# EAGLE design Instrument Cluster (EAGLE 6.5.0)
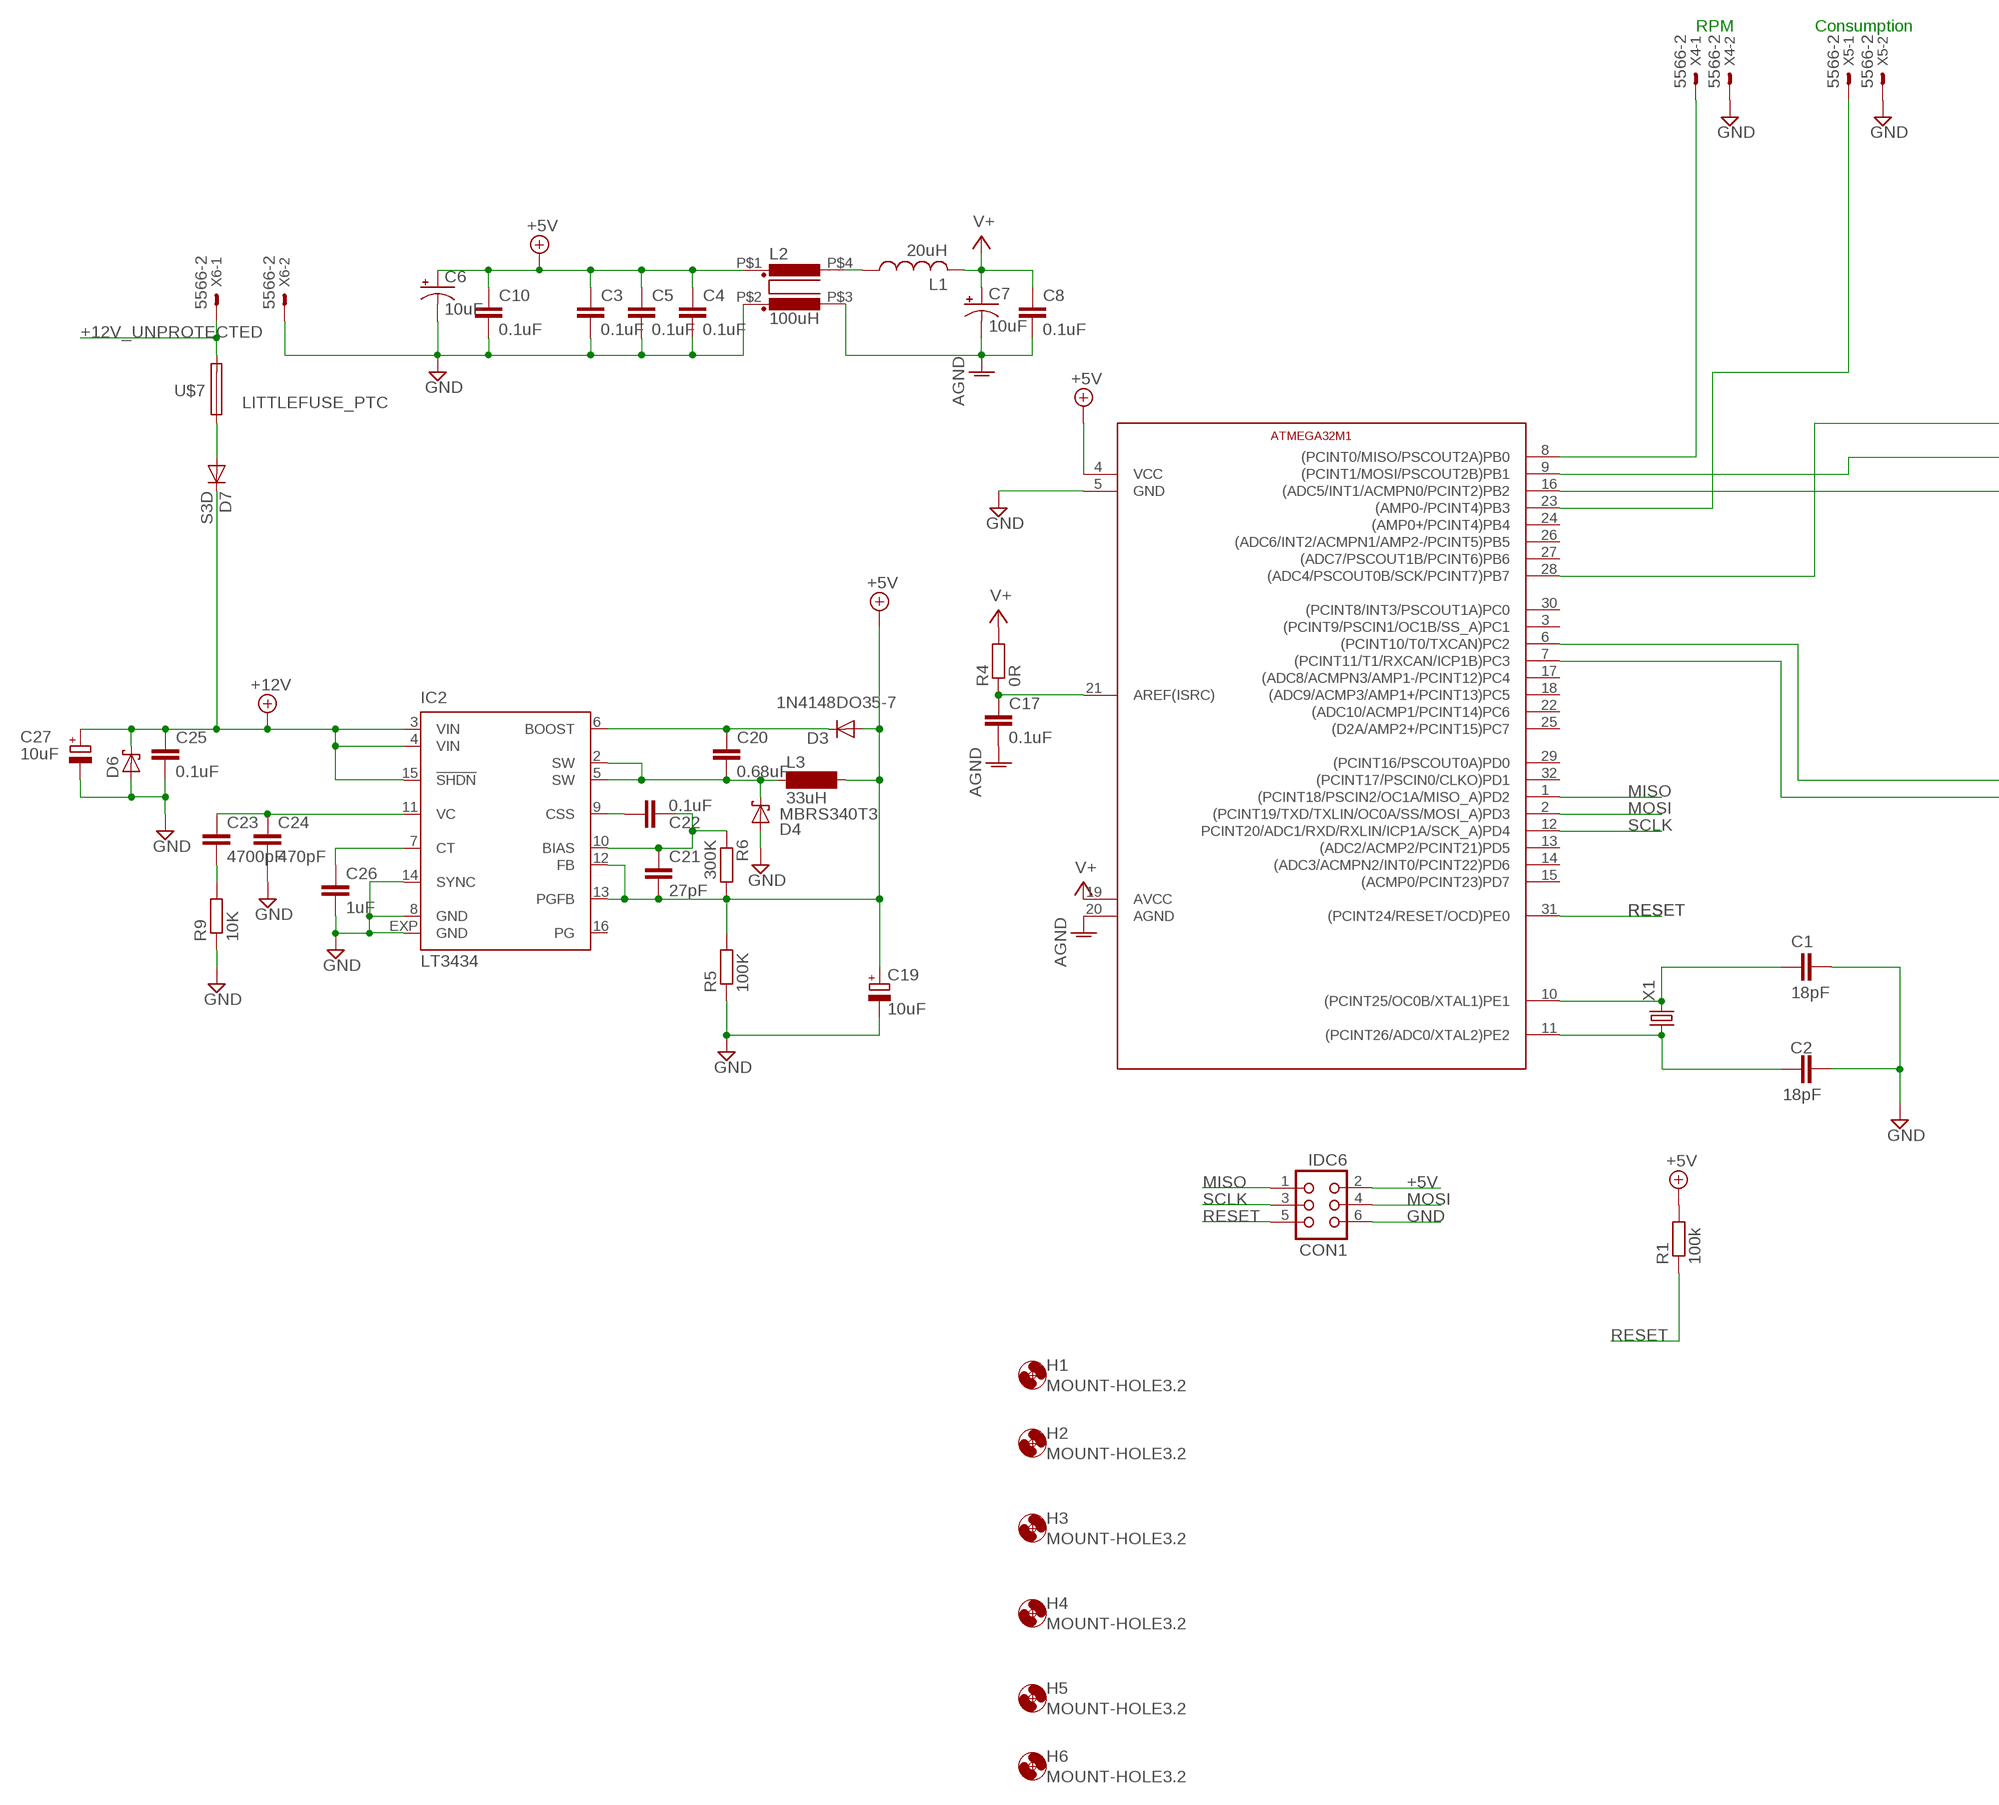
[diagram p0: schematic, sheet 1, part 1 of 2]
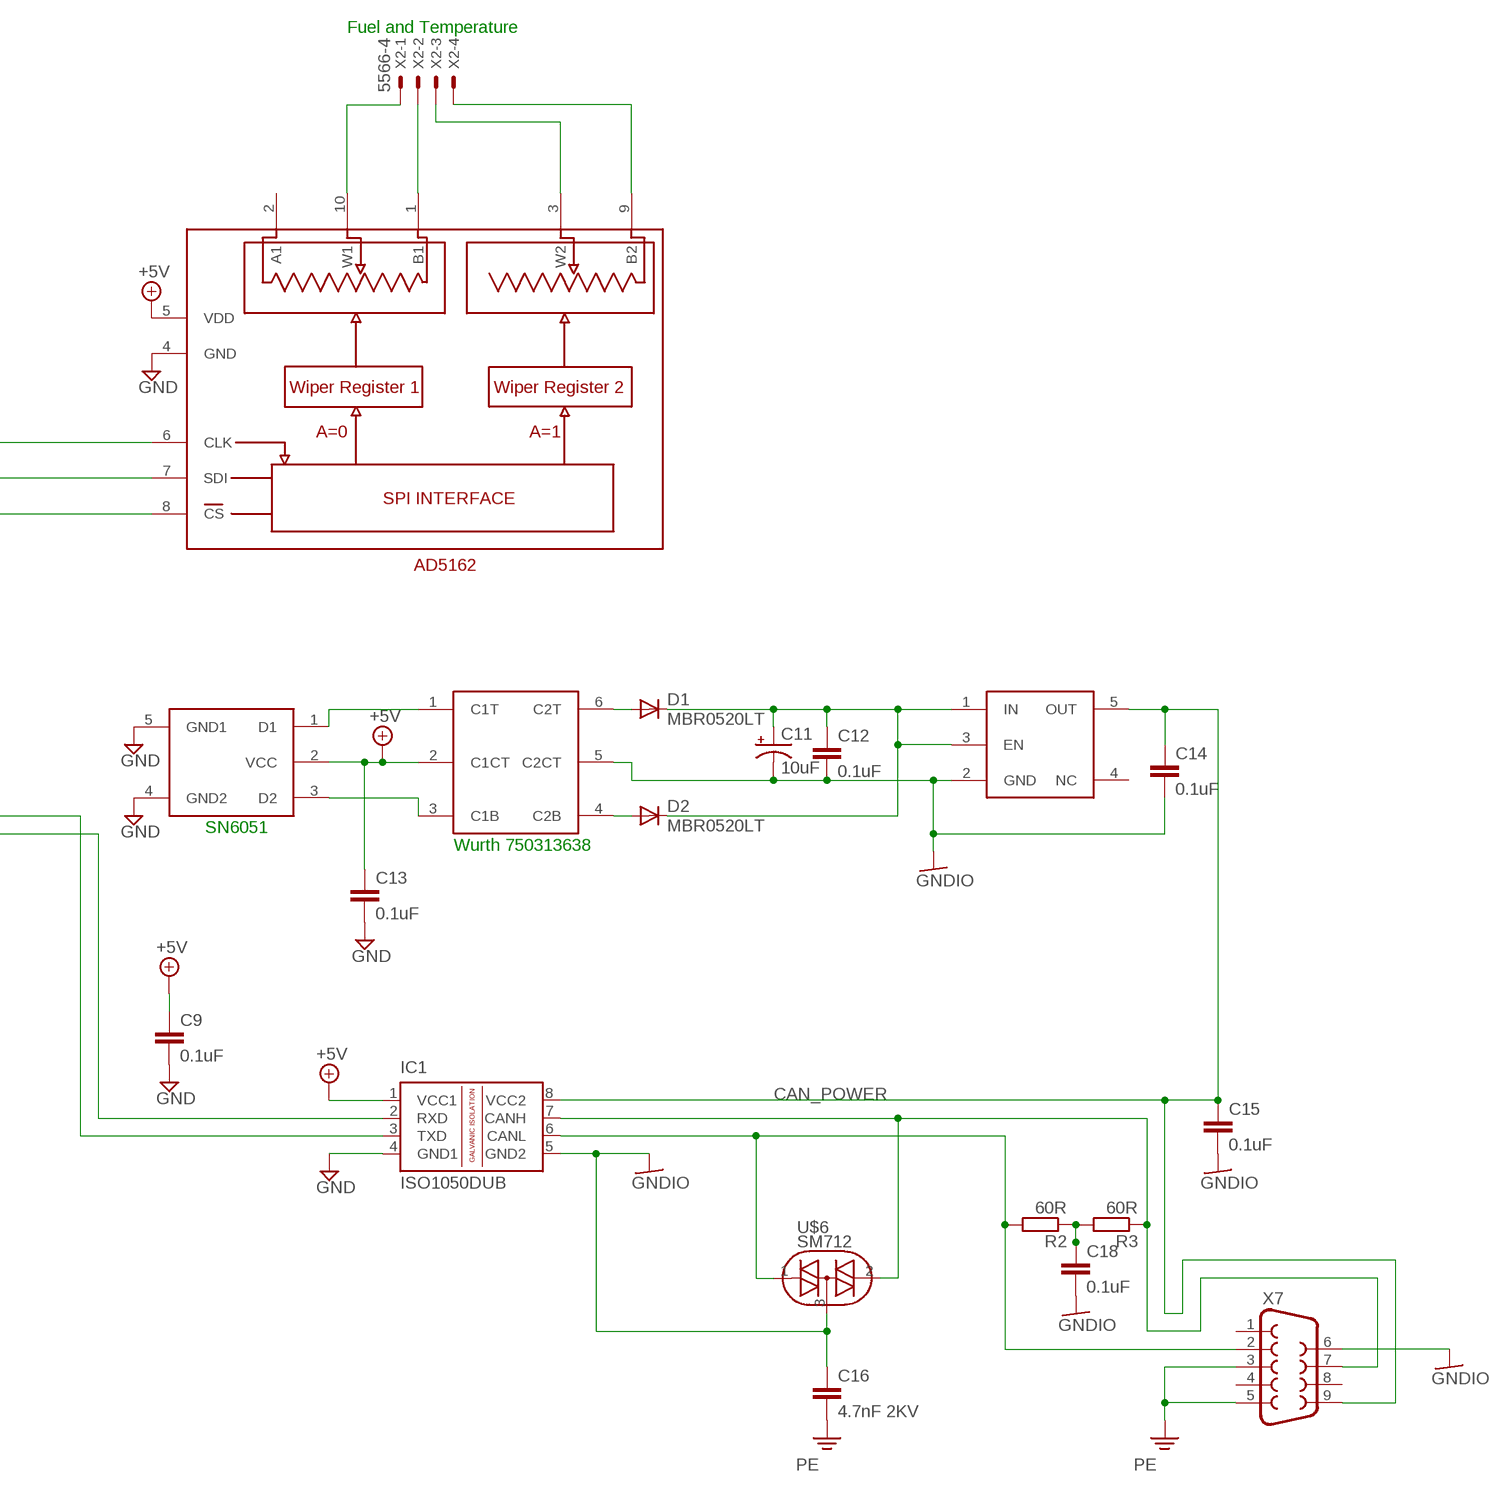
[diagram p1: schematic, sheet 1, part 2 of 2]

## Parts
C1  18pF  C-EUC0805  [C0805]
C2  18pF  C-EUC0805  [C0805]
C3  0.1uF  C-EUC0805  [C0805]
C4  0.1uF  C-EUC0805  [C0805]
C5  0.1uF  C-EUC0805  [C0805]
C6  10uF  CPOL-USSMCC  [SMC_C]
C7  10uF  CPOL-USSMCC  [SMC_C]
C8  0.1uF  C-EUC0805  [C0805]
C9  0.1uF  C-EUC0805  [C0805]
C10  0.1uF  C-EUC0805  [C0805]
C11  10uF  CPOL-USSMCD  [SMC_D]
C12  0.1uF  C-EUC0603  [C0603]
C13  0.1uF  C-EUC1206  [C1206]
C14  0.1uF  C-EUC1206  [C1206]
C15  0.1uF  C-EUC0603  [C0603]
C16  4.7nF 2KV  C-EUC1206  [C1206]
C17  0.1uF  C-EUC0805  [C0805]
C18  0.1uF  C-EUC1206  [C1206]
C19  10uF  CPOL-EUSMCD  [SMC_D]
C20  0.68uF  C-EUC0603  [C0603]
C21  27pF  C-EUC0603  [C0603]
C22  0.1uF  C-EUC0603  [C0603]
C23  4700pF  C-EUC0603  [C0603]
C24  470pF  C-EUC0603  [C0603]
C25  0.1uF  C-EUC0603  [C0603]
C26  1uF  C-EUC0603  [C0603]
C27  10uF  CPOL-EUSMCD  [SMC_D]
CON1  IDC6  CON06  [CON06]
D1  MBR0520LT  [SOD123]
D2  MBR0520LT  [SOD123]
D3  1N4148DO35-7  [DO35-7]
D4  MBRS340T3  [SMC]
D6  SCHOTTKY-DIODESMC  [SMC]
D7  S3D  DIODE-SMC  [SMC]
H1  MOUNT-HOLE3.2  [3,2]
H2  MOUNT-HOLE3.2  [3,2]
H3  MOUNT-HOLE3.2  [3,2]
H4  MOUNT-HOLE3.2  [3,2]
H5  MOUNT-HOLE3.2  [3,2]
H6  MOUNT-HOLE3.2  [3,2]
IC1  ISO1050DUB  [DUB-R-PDSO-G8]
IC2  LT3434  [TSSOP16EXP]
L1  20uH  L-USL3216C  [L3216C]
L2  100uH  R1003U  [CHIP]
L3  33uH  MS85  [MS85]
R1  100k  R-EU_R0603  [R0603]
R2  60R  R-EU_R0603  [R0603]
R3  60R  R-EU_R0603  [R0603]
R4  0R  R-EU_R0603  [R0603]
R5  100K  R-EU_R0603  [R0603]
R6  300K  R-EU_R0603  [R0603]
R9  10K  R-EU_R0603  [R0603]
U$1  ATMEGA32M1  [TQFP32-08]
U$2  AD5162  [MSOP10]
U$3  SN6501  [SOT23-DBV]
U$4  WURTHWURTH  [TSOT23-6_DDC]
U$5  TPS76350  [SOT23-DBV]
U$6  SM712  [SOT23]
U$7  LITTLEFUSE_PTC  [1812]
X1  CSM-7X-DU  [CSM-7X-DU]
X2  5566-4  [5566-4]
X4  5566-2  [5566-2]
X5  5566-2  [5566-2]
X6  5566-2  [5566-2]
X7  F09H  [F09H]

## Nets
+5V: C3.1 C4.1 C5.1 C6.+ C9.1 C10.1 C13.1 C19.+ C21.2 CON1.2 D3.A IC1.1(VCC1) IC2.12(FB) IC2.13(PGFB) L2.P$1 L3.2 R1.2 R5.2 R6.2 U$1.4(VCC) U$2.5(VDD) U$3.2(VCC) U$4.2(C1CT)
+12V: C25.1 C27.+ D6.C D7.C IC2.3(VIN) IC2.4(VIN) IC2.15(!SHDN)
+12V_UNPROTECTED: U$7.P$2 X6.1
AGND: C7.- C8.2 C17.2 L2.P$3 U$1.20(AGND)
CAN_POWER: C14.1 C15.1 IC1.8(VCC2) U$5.5(OUT) X7.9
GND: C1.1 C2.2 C3.2 C4.2 C5.2 C6.- C9.2 C10.2 C13.2 C19.- C24.2 C25.2 C26.2 C27.- CON1.6 D4.A D6.A IC1.4(GND1) IC2.8(GND) IC2.14(SYNC) IC2.EXP(GND) L2.P$2 R5.1 R9.1 U$1.5(GND) U$2.4(GND) U$3.4(GND2) U$3.5(GND1) X4.2 X5.2 X6.2
GNDIO: C11.- C12.2 C14.2 C15.2 C16.1 C18.2 IC1.5(GND2) U$4.5(C2CT) U$5.2(GND) U$6.3(T2) X7.6
MISO: CON1.1 U$1.1((PCINT18/PSCIN2/OC1A/MISO_A)PD2)
MOSI: CON1.4 U$1.2((PCINT19/TXD/TXLIN/OC0A/SS/MOSI_A)PD3)
N$1: C1.2 U$1.10((PCINT25/OC0B/XTAL1)PE1) X1.2
N$2: C2.1 U$1.11((PCINT26/ADC0/XTAL2)PE2) X1.1
N$3: U$1.9((PCINT1/MOSI/PSCOUT2B)PB1) U$2.7(SDI)
N$4: U$1.16((ADC5/INT1/ACMPN0/PCINT2)PB2) U$2.8(CS)
N$5: U$1.28((ADC4/PSCOUT0B/SCK/PCINT7)PB7) U$2.6(CLK)
N$6: U$2.10(W1) X2.1
N$7: U$2.1(B1) X2.2
N$8: U$2.3(W2) X2.3
N$9: U$2.9(B2) X2.4
N$10: IC1.3(TXD) U$1.6((PCINT10/T0/TXCAN)PC2)
N$11: IC1.2(RXD) U$1.7((PCINT11/T1/RXCAN/ICP1B)PC3)
N$12: U$3.1(D1) U$4.1(C1T)
N$13: U$3.3(D2) U$4.3(C1B)
N$14: D1.A U$4.6(C2T)
N$15: C11.+ C12.1 D1.C D2.C U$5.1(IN) U$5.3(EN)
N$16: C17.1 R4.1 U$1.21(AREF(ISRC))
N$17: L1.1 L2.P$4
N$18: D2.A U$4.4(C2B)
N$19: IC1.6(CANL) R2.2 U$6.1(T1) X7.2
N$20: IC1.7(CANH) R3.1 U$6.2(T3) X7.7
N$21: U$1.8((PCINT0/MISO/PSCOUT2A)PB0) X4.1
N$22: U$1.23((AMP0-/PCINT4)PB3) X5.1
N$23: C18.1 R2.1 R3.2
N$26: C22.1 IC2.9(CSS)
N$27: C20.1 D3.C IC2.6(BOOST)
N$28: C21.1 C22.2 IC2.10(BIAS) R6.1
N$29: C20.2 D4.C IC2.2(SW) IC2.5(SW) L3.1
N$30: C26.1 IC2.7(CT)
N$32: C23.1 C24.1 IC2.11(VC)
N$33: C23.2 R9.2
N$35: D7.A U$7.P$1
PE: C16.2 X7.3 X7.5
RESET: CON1.5 R1.1 U$1.31((PCINT24/RESET/OCD)PE0)
SCLK: CON1.3 U$1.12(PCINT20/ADC1/RXD/RXLIN/ICP1A/SCK_A)PD4)
V+: C7.+ C8.1 L1.2 R4.2 U$1.19(AVCC)
Unconnected: IC2.16(PG) U$1.3((PCINT9/PSCIN1/OC1B/SS_A)PC1) U$1.13((ADC2/ACMP2/PCINT21)PD5) U$1.14((ADC3/ACMPN2/INT0/PCINT22)PD6) U$1.15((ACMP0/PCINT23)PD7) U$1.17((ADC8/ACMPN3/AMP1-/PCINT12)PC4) U$1.18((ADC9/ACMP3/AMP1+/PCINT13)PC5) U$1.22((ADC10/ACMP1/PCINT14)PC6) U$1.24((AMP0+/PCINT4)PB4) U$1.25((D2A/AMP2+/PCINT15)PC7) U$1.26((ADC6/INT2/ACMPN1/AMP2-/PCINT5)PB5) U$1.27((ADC7/PSCOUT1B/PCINT6)PB6) U$1.29((PCINT16/PSCOUT0A)PD0) U$1.30((PCINT8/INT3/PSCOUT1A)PC0) U$1.32((PCINT17/PSCIN0/CLKO)PD1) U$2.2(A1) U$5.4(NC) X7.1 X7.4 X7.8

## Notes on the sheet
- RPM | Consumption | Fuel and Temperature
- SN6051
- Wurth 750313638

## Library data of the parts
C1-C5 C8-C10 C12-C18 C20-C26 = rcl:C-EU: CAPACITOR, European symbol
C6 C7 C11 = rcl:CPOL-US: POLARIZED CAPACITOR, American symbol
C19 C27 = rcl:CPOL-EU: POLARIZED CAPACITOR, European symbol
CON1 = con-harting:CON06: CONNECTOR; OC_FARNELL: unknown; OC_NEWARK: unknown
D1 D2 = diode:MBR0520LT: SCHOTTKY BARRIER RECTIFIER Source: http://onsemi.com .. MBR0520LT1-D.pdf
D3 = diode:1N4148: DIODE high speed (Philips)
D4 = diode:MBRS3*0T3: SCHOTTKY BARRIER RECTIFIER 3.0 AMPERES 20, 30, 40 VOLT Source: MBRS340T3-D.pdf
D6 = diode:SCHOTTKY-DIODE: Schottky Diode
D7 = diode:DIODE-: DIODE
H1-H6 = holes:MOUNT-HOLE: MOUNTING HOLE with drill center marker
IC1 = texas:ISO1050: ISOLATED CAN TRANSCEIVER Source: http://focus.ti.com/lit/ds/symlink/iso1050.pdf; MPN: ISO1050DUBR; OC_FARNELL: 1755712; OC_NEWARK: 14R9899
IC2 = linear-technology:LT3434: High Voltage 3A, 200kHz Step-Down Switching Regulator with 100µA Quiescent Current Spurce: www.linear.com .. 3434fb.pdf; MPN: LT3434EFE#PBF; OC_FARNELL: 1501035; OC_NEWARK: 57M8118
L1 = rcl:L-US: INDUCTOR, American symbol
L2 = inductor-nkl:R1003U: Gleichtakt-Entstördrossel (über typ. 5MHz) common mode choke (above typ.5MHz)
L3 = inductor-neosid:MS85: INDUCTOR SMD power inductor; OC_FARNELL: unknown; OC_NEWARK: unknown
R1-R6 R9 = rcl:R-EU_: RESISTOR, European symbol
U$1 = atmel:ATMEGA32M1: The Atmel ATmega16M1/32M1/64M1 is a low-power CM OS 8-bit microcontroller based on the AVR enhanced RISC architecture. By executing powerful instructi ons in a single clock cycle, the ATmega16M1/32M1/64M1 achieves throughputs approaching 1 MIPS per MHz allowing the system designer to optimize power consumption versus processing speed.
U$2 = analog-devices:AD5162
U$3 = texas:SN6501
U$4 = texas:WURTH
U$5 = texas:TPS76350
U$6 = diode:SM712
U$7 = fuse:LITTLEFUSE_PTC
X1 = crystal:CSM-7X-DU: SMD CRYSTAL Source: www.ecsxtal.com .. Crystal 3.6864MHz CSM_7X_DU.PDF; OC_FARNELL: unknown; OC_NEWARK: unknown
X2 = con-molex:5566-4: Mini FIT connector 4 pol Source: http://www.molex.com; OC_FARNELL: unknown; OC_NEWARK: unknown
X4-X6 = con-molex:5566-2: Mini FIT connector 2 pol Source: http://www.molex.com; OC_FARNELL: 1822072; OC_NEWARK: unknown
X7 = con-subd:F09: SUB-D; OC_FARNELL: unknown; OC_NEWARK: unknown

## Net classes
0 All: width 0.152 mm, drill 0.381 mm, clearance 0.254 mm

## Board
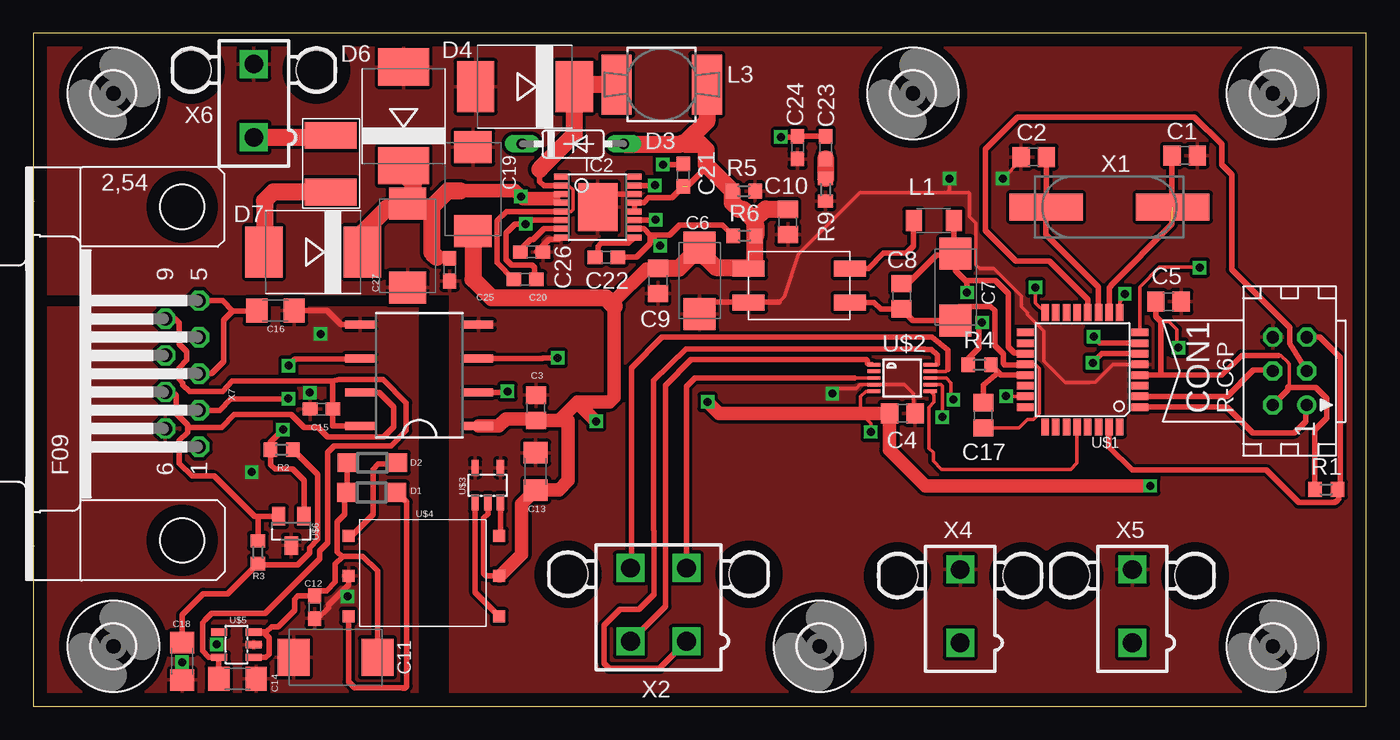
[diagram p2: board, top side]
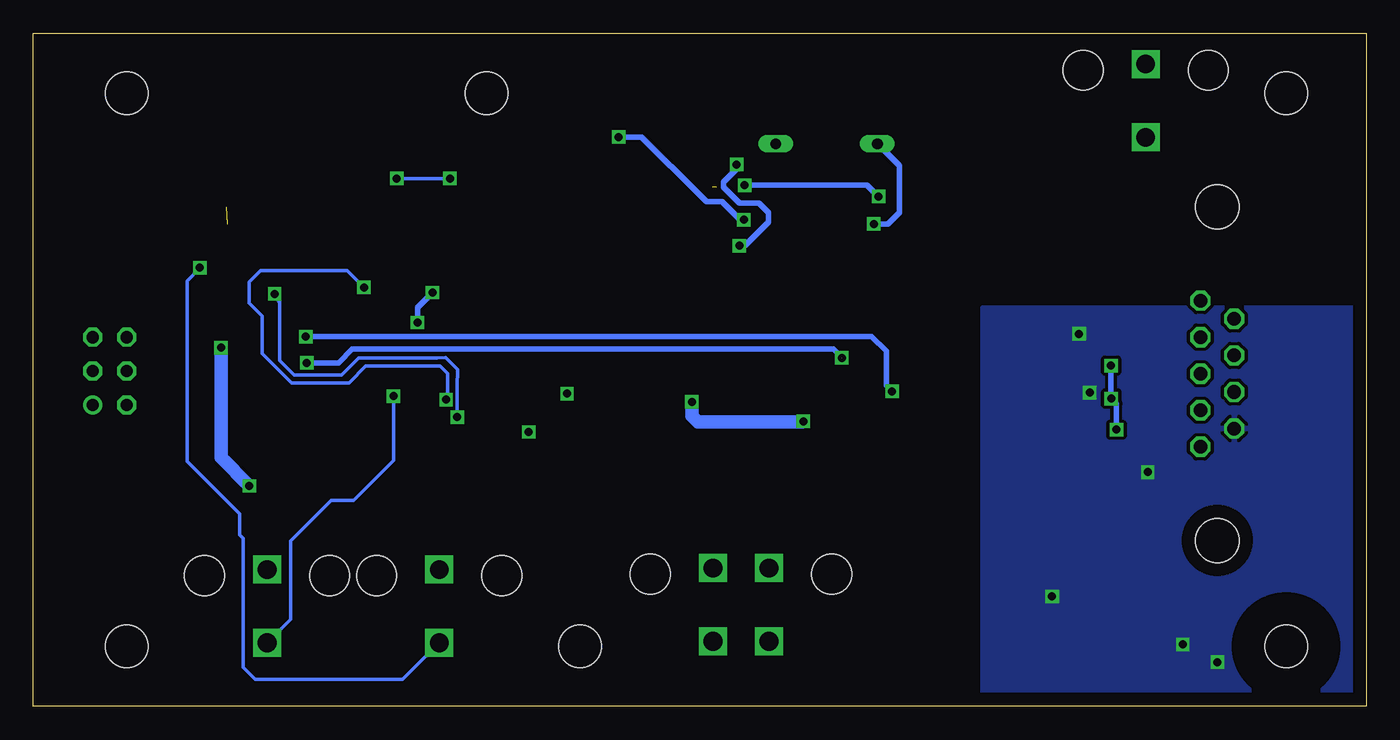
[diagram p3: board, bottom side, seen from below]

Size 100.01 x 50.51 mm. Coordinates in mm from the lower left corner, seen from the top.
Outline: 0,0 100,0 100.01,50.51 0,50.5 0,0
Copper layers (1*16): Top 0.035mm / dielectric 1.5mm / Bottom 0.035mm
Design rules "default *": minimum track width 6mil, minimum drill 15mil, track to track 6mil, track to pad 6mil, pad to pad 6mil, via to via 6mil, smd to smd 6mil, copper to edge 40mil, drill to drill 8mil, minimum pad ring 10mil, minimum via ring 8mil, stop-mask expansion 4mil, vias tented up to drill 0mil, thermal gap 10mil

### Footprints (pad centres in the part's own frame; a part is rotated, then mirrored left to right if it is on the bottom)
C0805 = smd 1.3 x 1.5: 1 -0.95,0; 2 0.95,0
SMC_C = smd 2.4 x 2.4: + -2.5,0; - 2.5,0
SMC_D = smd 2.4 x 2.8: + -3.15,0; - 3.15,0
C0603 = smd 1.1 x 1: 1 -0.85,0; 2 0.85,0
C1206 = smd 1.6 x 1.8: 1 -1.4,0; 2 1.4,0
CON06 = drill 0.914: 1 -2.54,-1.27 | drill 0.914 octagon: 2 -2.54,1.27; 3 0,-1.27; 4 0,1.27; 5 2.54,-1.27; 6 2.54,1.27
SOD123 = smd 1.4 x 1.4: A 1.9,0; C -1.9,0
DO35-7 = drill 0.813 long: A 3.81,0; C -3.81,0
SMC = smd 2.8 x 3.8: A 3.7,0; C -3.7,0
3,2 = hole 3.2: 0,0
DUB-R-PDSO-G8 = smd 0.6 x 2.2: 1 -3.81,-4.445; 2 -1.27,-4.445; 3 1.27,-4.445; 4 3.81,-4.445; 5 3.81,4.445; 6 1.27,4.445; 7 -1.27,4.445; 8 -3.81,4.445
TSSOP16EXP = smd 0.45 x 1.05: 1 -2.275,-2.768; 2 -1.625,-2.768; 3 -0.975,-2.768; 4 -0.325,-2.768; 5 0.325,-2.768; 6 0.975,-2.768; 7 1.625,-2.768; 8 2.275,-2.768; 9 2.275,2.768; 10 1.625,2.768; 11 0.975,2.768; 12 0.325,2.768; 13 -0.325,2.768; 14 -0.975,2.768; 15 -1.625,2.768; 16 -2.275,2.768 | smd 3.58 x 2.94: EXP 0,0
L3216C = smd 1.2 x 1.6: 1 -1.5,0; 2 1.5,0
CHIP = smd 2.4 x 1.2: P$1 0,2.54; P$2 0,0; P$3 7.62,0; P$4 7.62,2.54
MS85 = smd 4.5 x 2.25: 1 0,-3.383; 2 0,3.383
R0603 = smd 1 x 1.1: 1 -0.85,0; 2 0.85,0
TQFP32-08 = smd 1.27 x 0.559: 1 -4.293,2.8; 2 -4.293,2; 3 -4.293,1.2; 4 -4.293,0.4; 5 -4.293,-0.4; 6 -4.293,-1.2; 7 -4.293,-2; 8 -4.293,-2.8; 17 4.293,-2.8; 18 4.293,-2; 19 4.293,-1.2; 20 4.293,-0.4; 21 4.293,0.4; 22 4.293,1.2; 23 4.293,2; 24 4.293,2.8 | smd 0.559 x 1.27: 9 -2.8,-4.293; 10 -2,-4.293; 11 -1.2,-4.293; 12 -0.4,-4.293; 13 0.4,-4.293; 14 1.2,-4.293; 15 2,-4.293; 16 2.8,-4.293; 25 2.8,4.293; 26 2,4.293; 27 1.2,4.293; 28 0.4,4.293; 29 -0.4,4.293; 30 -1.2,4.293; 31 -2,4.293; 32 -2.8,4.293
MSOP10 = smd 0.25 x 1: 1 -1,-2.113; 2 -0.5,-2.113; 3 0,-2.113; 4 0.5,-2.113; 5 1,-2.113; 6 1,2.113; 7 0.5,2.113; 8 0,2.113; 9 -0.5,2.113; 10 -1,2.113
SOT23-DBV = smd 0.55 x 1.2: 1 -0.95,-1.3; 2 0,-1.3; 3 0.95,-1.3; 4 0.95,1.3; 5 -0.95,1.3
TSOT23-6_DDC = smd 0.9 x 0.9: 1 -3.03,-5.64; 2 0,-5.64; 3 3.03,-5.65; 4 3.03,5.65; 5 0,5.66; 6 -3.01,5.66
SOT23 = smd 1 x 1.4: 1 -0.95,-1.1; 2 0.95,-1.1; 3 0,1.1
1812 = smd 2 x 3.9: P$1 0,-0.03; P$2 4.25,-0.03
CSM-7X-DU = smd 5.5 x 2: 1 -4.75,0; 2 4.75,0
5566-4 = drill 1.4 square: 1 2.1,-2.75; 2 -2.1,-2.75; 3 2.1,2.75; 4 -2.1,2.75 | hole 3: 6.8,2.29; -6.8,2.29
5566-2 = drill 1.4 square: 1 0,-2.75; 2 0,2.75 | hole 3: 4.7,2.29; -4.7,2.29
F09H = drill 1.016 octagon: 1 -5.486,-1.27; 2 -2.743,-1.27; 3 0,-1.27; 4 2.743,-1.27; 5 5.486,-1.27; 6 -4.115,1.27; 7 -1.372,1.27; 8 1.372,1.27; 9 4.115,1.27 | hole 3.302: -12.522,0; 12.522,0

### Placement (x,y rotation side)
C1  86.39,41.34 180 top
C2  75.06,41.23 180 top
C3  37.71,22.4 90 top
C4  65.21,21.98 0 top
C5  85.18,30.37 0 top
C6  50,31.94 270 top
C7  69.2,31.47 270 top
C8  65.15,30.78 270 top
C9  46.87,31.93 270 top
C10  56.62,36.35 270 top
C11  22.68,3.67 180 top
C12  21.11,7.44 270 top
C13  37.7,17.63 90 top
C14  15.32,2.07 0 top
C15  21.62,22.31 180 top
C16  18.17,29.69 180 top
C17  71.28,21.84 270 top
C18  11.17,3.37 270 top
C19  32.99,38.81 90 top
C20  36.9,32.04 180 top
C21  48.76,39.86 270 top
C22  43,33.7 0 top
C23  59.45,41.93 270 top
C24  57.34,41.93 270 top
C25  31.24,32.76 270 top
C26  37.38,34.09 0 top
C27  28.09,34.57 270 top
CON1  94.28,25.16 90 top
D1  25.39,16.05 0 top
D2  25.45,18.28 0 top
D3  40.49,42.21 0 top
D4  36.88,46.5 180 top
D6  27.78,44.28 90 top
D7  21,34.09 180 top
H1  6,46 0 top
H2  6,4.5 0 top
H3  93,4.5 0 top
H4  93,46 0 top
H5  66,46 0 top
H6  59,4.5 0 top
IC1  28.96,24.83 90 top
IC2  42.35,37.47 270 top
L1  67.56,36.45 0 top
L2  53.67,30.31 0 top
L3  47.15,46.66 270 top
R1  97.02,16.27 180 top
R2  18.63,19.25 180 top
R3  16.85,11.56 270 top
R4  71,25.62 180 top
R5  53.31,38.66 180 top
R6  53.37,35.32 0 top
R9  59.44,38.76 90 top
U$1  78.72,25.26 180 top
U$2  65.19,24.64 270 top
U$3  34.1,16.59 0 top
U$4  29.31,9.77 90 top
U$5  15.25,4.62 90 top
U$6  19.36,13.16 180 top
U$7  22.29,38.59 90 top
X1  80.74,37.46 0 top
X2  46.91,7.62 0 top
X4  69.55,7.51 0 top
X5  82.47,7.51 0 top
X6  16.54,45.45 0 top
X7  11.17,24.96 90 top

### Tracks (layer width: path | path; a pad name or v marks a point on that pad's centre or on a via)
+5V  (via drill 0.6)  (1 unrouted)
  Top 0.254: 40.83,22.84 40.82,22.85 | U$2.5 63.07,23.63 62.47,23.63 62.08,23.24 62.08,21.98 62.84,21.22 v62.84,20.59 | v85.93,26.92 85.82,27.03 85.82,28.29 85.22,28.89 84.6,28.89 | 93.43,26.34 93.62,26.34 94.11,25.85 94.11,25.83 94.15,25.79 94.15,25.78 94.24,25.69 94.24,23.98 94.28,23.94
  Top 0.406: 84.66,24.86 89.19,24.86 90.67,26.34 93.43,26.34 | CON1.2 94.11,23.72 94.11,23.97 94.14,23.94 94.28,23.94 96.22,23.94 97.06,23.1 97.06,21.62 96.17,20.73 R1.2 | 53.5,32.68 L2.P$1 | U$1.4 84.66,24.86 | 84.66,24.86 84.6,24.92 84.6,28.89 84.23,29.26 C5.1 | U$3.2 34.11,14.45 33.79,14.13 33.79,9.96 33.98,9.77 U$4.2 | 49.03,39.01 50.57,40.55 | IC2.12 IC2.13 45.8,37.8 46.17,38.16 47.91,38.16 C21.2
  Top 1: 46.82,32.93 C9.1 46.82,32.83 46.01,32.83 43.59,30.41 43.59,30.03 43.59,23.18 43.25,22.84 40.83,22.84 40.66,22.66 | 40.66,22.66 39.44,21.45 C3.1 | C3.1 37.6,21.56 35.46,21.56 34.92,21.02 IC1.1 | C3.1 40.14,21.46 40.14,16.94 39.43,16.23 C13.1 36.64,15.17 36.64,11.4 35.01,9.77 U$4.2 | v42.24,21.38 40.95,22.66 40.66,22.66 | v50.59,22.85 51.46,21.98 62.08,21.98 C4.1 64.23,21.95 64.23,19.24 66.93,16.54 v83.81,16.54
  Top 1.27: C19.+ 32.99,32.06 34.39,30.66 42.96,30.66 43.59,30.03 | L3.2 50.53,43.91 48.99,42.37 48.98,42.37 48.81,42.2 | 48.81,42.2 48.63,42.2 | D3.A 48.63,42.2 | 48.63,42.2 48.72,42.29 | 48.81,42.2 50.05,42.2 50.48,41.77 50.48,40.64 50.57,40.55 R5.2 52.46,37.78 52.94,37.3 53.27,37.3 54.12,36.45 | 54.12,36.45 54.12,36.22 | 54.12,36.22 54.12,33.3 L2.P$1 53.59,32.93 51.21,32.93 50,34.14 C6.+ 48.44,32.88 C9.1 | 54.12,36.45 54.12,36.51 54.94,37.33 56.59,37.33 C10.1 | 54.12,36.22 54.22,36.12 R6.2
  Bottom 1: v42.24,21.38 42.28,21.34 50.13,21.34 50.59,21.8 v50.59,22.85 | v83.81,16.54 85.93,18.66 v85.93,26.92
+12V  (via drill 0.6)
  Top 0.254: 39.03,38.1 39.18,38.1 | 39.18,38.1 39.28,38.1 IC2.4 | IC2.3 39.52,38.45 39.18,38.1
  Top 0.4: C25.1 30.36,33.61 30.26,33.71
  Top 0.406: IC2.15 46.62,39.09 v46.64,39.11
  Top 1: 39.03,38.1 39.02,38.09 36.75,38.09 v36.58,38.26 36.15,38.69 32.05,38.69
  Top 1.27: D7.C 24.7,35.57 26.5,37.37 28.42,37.37 C27.+ | D6.C 27.78,39.93 28.52,39.19 C27.+ | C27.+ 29.9,37.47 | 29.9,37.47 31.1,38.67 31.15,38.67 31.18,38.7 32.04,38.7 32.05,38.69 | 29.9,37.47 29.9,34.07 30.26,33.71
  Bottom 0.406: v46.64,39.11 37.46,39.11 v36.58,38.26
+12V_UNPROTECTED
  Top 1.27: X6.1 22.18,42.7 U$7.P$2
AGND
  Top 0.254: 72.87,25.62 72.9,25.65 75.18,25.65 75.48,25.35 75.48,21.98 75.04,21.54 74.6,21.54 73.95,20.89 C17.2
  Top 0.406: C7.- 70.14,28.97 | U$1.20 74.39,25.62 72.87,25.62 72.78,25.71 72.78,26.42 72.14,27.06 72.14,29.7 71.82,30.02 69.54,30.02 69.2,29.68 C7.- | L2.P$3 63.09,30.31 63.59,29.81 65.13,29.81 C8.2 66.01,28.97 C7.-
CAN_POWER
  Top 0.406: IC1.8 22.47,21.02 C15.1 22.47,23.06 22.48,24.41 | 22.48,24.41 21.57,24.42 14.91,24.42 14.2,23.61 11.73,23.61 11.22,24.12 11.22,24.28 10.93,24.57 10.93,25.4 11.52,25.99 11.52,26.63 10.95,27.2 10.95,28.77 10.8,28.92 10.78,28.92 10.59,29.11 9.94,29.11 X7.9 | C14.1 13.92,3.64 U$5.5 | U$5.5 14.33,3.67 | U$5.5 13.93,3.69 13.16,3.69 12.69,4.16 12.69,6.26 12.91,6.48 12.91,6.49 13.39,6.97 17.38,6.97 21.49,11.08 21.49,11.67 22.1,12.28 22.1,19.06 22.58,19.54 26.83,19.54 27.98,20.69 27.98,22.78 26.24,24.52 22.94,24.52 22.48,24.41
GND  (via drill 0.6)
  Top 0.254: C4.2 66.05,22.09 66.05,23.47 65.38,24.14 U$2.4 62.04,24.14 61.76,23.86 60.36,23.86 v59.96,23.46 | U$1.5 81,25.66 79.73,24.39 79.68,24.32 79.28,24.31 77.44,24.31 75.83,25.92 75.83,28.18 74.6,29.41 74.6,29.54 74.13,30.01 74.13,30.78 72.06,32.85 71.01,32.85 70.73,33.13 70.73,36.28 70.25,36.76 70.25,38.52 70.21,38.56 68.55,38.56 | 68.55,38.56 62.03,38.56 57.42,33.95 56.36,30.74 55.96,30.34 53.68,30.34 | C2.2 74.11,40.98 v72.74,39.61 | v68.75,39.61 68.75,38.76 68.55,38.56
  Top 0.406: 55.96,30.34 50.9,30.34 C6.- | IC2.14 43.33,38.45 IC2.EXP 42.35,36.38 | IC2.8 39.41,35.02 38.7,35.02 37.76,34.08 C26.2
  Bottom 0.254: v72.74,39.61 v68.75,39.61 | v59.96,23.46 v59.95,23.46 v59.95,23.45 59.96,23.44
  pour Top: 31.32,30.99 0.07,30.99 0.07,49.98 100.01,49.98 100.01,-0.02 31.31,-0.02
GNDIO  (via drill 0.6)
  Top 0.406: IC1.5 23.09,28.64 22.05,29.69 C16.1 | C18.2 11.45,1.69 | C12.2 21.34,6.59 22.14,7.39 22.14,7.6 23.04,8.5 23.07,8.5 23.67,9.1 23.67,9.75 U$4.5
  other vias: 16.38,17.57 20.74,23.54 23.57,8.24 21.54,27.95 11.16,3.31 13.76,4.64
  pour Top: 0.07,29.9 28.78,29.9 28.78,-0.01 0.1,0.01
  pour Bottom: 0,0 28.76,0 28.76,0.02 28.75,0.02 28.75,29.9 0,29.9
MISO
  Top 0.406: U$1.1 89.57,22.46 91.5,20.53 94.62,20.53 95.48,21.39 95.48,22.55 CON1.1
MOSI
  Top 0.406: U$1.2 89.58,23.26 91.54,25.22 92.95,25.22 CON1.4
N$1  (1 unrouted)
  Top 0.406: C1.2 85.44,36.19 80.84,31.59 80.84,31.5 80.75,31.41 80.75,29.58 U$1.10
N$2
  Top 0.406: C2.1 76.01,37.48 X1.1 75.98,35.4 77.93,33.45 77.93,33.44 79.92,31.45 U$1.11
N$3  (via drill 0.6, 0.6 pad 0.41)
  Top 0.254: v81.9,30.95 81.52,30.34 U$1.9 | U$2.7 68.11,24.14 68.2,24.05 v68.2,21.71
  Bottom 0.254: v68.2,21.71 68.2,23.98 68.19,25.26 69.09,26.16 69.72,26.14 75.6,26.14 76.87,24.87 80.43,24.87 81.51,25.95 81.51,30.33 v81.9,30.95
N$4  (via drill 0.6)
  Top 0.254: U$1.16 75.2,30.27 v75.2,31.43 | U$2.8 68.5,24.64 68.86,24.28 68.86,23.33 v69.04,23.02
  Bottom 0.254: v69.04,23.02 68.94,23.24 68.94,24.96 69.5,25.52 75.06,25.52 76.32,24.26 80.64,24.26 82.84,26.46 82.84,29.29 83.82,30.27 83.82,31.84 82.95,32.71 76.48,32.71 v75.2,31.43
N$5
  Top 0.254: 67.52,23.42 U$2.6 67.59,23.35 67.59,22.82 67.21,22.44 67.21,19.36 67.52,19.05 67.52,18.4 68.15,17.77 77.84,17.77 78.32,18.25 U$1.28
N$6
  Top 0.254: 67.82,25.7 67.76,25.64 U$2.10
  Top 0.406: X2.1 46.99,2.85 43.2,2.85 42.83,3.22 42.83,6.08 44.04,7.29 45.45,7.29 46.57,8.41 46.57,13.13 46.53,13.27 46.53,24.44 48.99,26.8 66.85,26.8 66.87,26.78 67.4,26.78 67.82,26.36 67.82,25.7
N$7
  Top 0.254: 62.58,25.74 62.98,25.74 U$2.1
  Top 0.406: X2.2 47.44,7.5 47.44,24.09 49.36,26.01 62.48,26.01 62.58,25.91 62.58,25.74
N$8
  Top 0.254: U$2.3 61.6,24.64
  Top 0.406: X2.3 49,24.01 49.63,24.64 61.6,24.64
N$9
  Top 0.254: U$2.9 68.49,25.14 68.63,25.28
  Top 0.406: X2.4 44.87,10.43 44.87,25.4 47.17,27.7 67.44,27.7 68.62,26.75 68.63,25.28
N$10  (via drill 0.6)  (1 unrouted)
  Top 0.406: v79.49,25.77 80.18,26.46 U$1.6 | IC1.3 33.42,26.09 38.18,26.09 38.24,26.15 v39.34,26.15
  Bottom 0.406: v79.49,25.77 77.11,25.77 76.08,26.8 39.98,26.8 39.32,26.14
N$11  (via drill 0.6)
  Top 0.406: v35.58,23.63 35.52,23.57 IC1.2 | v79.56,27.74 80.04,27.26 U$1.7
  Bottom 0.406: v79.56,27.74 79.54,27.76 37.11,27.76 36.01,26.66 36.01,24.06 v35.58,23.63
N$12
  Top 0.406: U$4.1 33.15,8.54 U$3.1
N$13
  Top 0.406: U$4.3 35.05,12.89 U$3.3
N$14
  Top 0.406: U$4.6 23.65,1.82 24.1,1.37 27.7,1.37 27.73,1.34 27.86,1.34 28.02,1.5 28.02,15.32 D1.A
N$15
  Top 0.406: D2.C 23.55,16.11 D1.C 23.37,15.93 23.37,14.4 22.8,13.83 22.8,11.6 23.19,11.21 | C11.+ 25.83,10.15 24.72,11.26 23.24,11.26 23.19,11.21 | U$5.1 17.45,3.67 17.69,3.91 17.69,5.15 17.31,5.53 16.59,5.53 U$5.3 17.48,5.57 17.88,5.97 18.36,5.97 19.59,7.2 19.59,8.04 19.84,8.29 C12.1 21.49,8.67 21.99,8.67 22.65,9.33 22.65,10.67 23.19,11.21
N$16
  Top 0.406: U$1.21 72.61,24.86 72.42,25.05 | 72.42,25.05 R4.1 | C17.1 71.27,24.12 72.42,25.05
N$17
  Top 0.406: L1.1 66.03,36.42 66.03,34.53 65.5,34 63.8,34 62.65,32.85 L2.P$4
N$18
  Top 0.406: U$4.4 23.89,12.8 25.48,14.39 25.48,17.79 25.86,18.17 27.24,18.17 D2.A
N$19  (via drill 0.6)
  Top 0.406: IC1.6 24.48,26.07 19.64,26.07 v19.14,25.57 | X7.2 13.98,22.22 14.81,23.05 19.09,23.05 v19.13,23.09 | U$6.1 20.3,16.95 19.45,17.8 18.13,17.8 17.81,18.12 17.81,19.23 R2.2 17.78,19.8 v18.74,20.76
  Bottom 0.406: v19.14,25.57 v19.14,23.1 v19.13,23.09 | 19.14,23.05 v19.13,23.09 | v18.74,20.76 18.74,22.7 v19.13,23.09
N$20
  Top 0.406: U$6.2 16.83,14.26 | 16.83,14.26 16.59,14.26 13.57,17.28 11.92,17.28 10.96,18.24 10.96,19.95 11.57,20.56 11.57,20.87 | 11.57,20.87 11.57,21.11 10.71,21.97 10.71,23.34 10.62,23.43 10.06,23.43 X7.7 | IC1.7 25.96,23.57 27.05,22.48 27.05,20.96 26.3,20.21 22.09,20.21 21.4,20.9 21.4,20.92 20.31,20.92 19.34,21.89 15.07,21.89 14.12,20.94 11.64,20.94 11.57,20.87 | R3.1 16.85,14.23 16.83,14.26
N$21  (via drill 0.6)
  Top 0.254: U$1.8 83.01,31.47 84.5,32.96 87.48,32.96 v87.52,32.92
  Bottom 0.254: v87.52,32.92 87.52,32.88 88.47,31.93 88.47,18.36 84.53,14.42 84.53,12.85 84.27,12.59 84.27,2.93 83.36,2.02 72.29,2.02 X4.1
N$22  (via drill 0.6)
  Top 0.254: U$1.23 v72.99,23.26 v72.98,23.27
  Bottom 0.254: v72.98,23.27 72.98,18.44 75.98,15.44 77.65,15.44 80.69,12.4 80.69,6.54 X5.1
N$23
  Top 0.406: C18.1 11.16,6.86 12.75,8.45 14.6,8.45 R3.2 16.95,10.61 19.84,10.61 20.74,11.51 20.74,11.9 21.35,12.51 21.35,17.39 R2.1
N$26
  Top 0.406: IC2.9 44.67,34.75 42.6,34.75 42.36,34.51 42.36,33.91 C22.1
N$27  (via drill 0.6)
  Top 0.406: IC2.6 37.23,36.49 v36.94,36.2 36.16,36.2 35.57,35.61 35.56,35.61 35.52,35.57 35.51,35.57 35.46,35.52 35.46,33.53 35.88,33.11 37.41,33.11 37.6,32.92 37.6,32.19 C20.1
  Bottom 0.406: v36.94,36.2 35.88,36.2 35.86,36.22 35.86,36.23 35.04,37.05 35.04,40.57 D3.C
N$28  (via drill 0.6)
  Top 0.406: C22.2 45.27,33.7 46.28,34.71 46.28,35.32 | 46.28,35.35 46.28,35.37 | 46.28,35.37 45.85,35.8 45.85,35.81 45.79,35.87 45.14,35.87 IC2.10 | 46.28,35.37 47.72,35.37 48.46,36.11 | 48.46,36.11 51.73,36.11 R6.1 | 48.46,36.11 48.46,36.09 47.74,35.37 46.3,35.37 46.28,35.35 | 46.28,35.35 46.28,35.32 | 46.28,35.32 v47.03,34.57 | v47.24,40.67 48.72,40.67 C21.1
  Bottom 0.406: v47.03,34.57 46.62,34.57 44.85,36.34 44.85,37.05 45.55,37.75 47.01,37.75 48.21,38.95 48.21,39.35 47.22,40.34 47.22,40.65 v47.24,40.67
N$29
  Top 0.254: 39.57,39.08 IC2.2 40.15,39.09 40.48,38.76 40.48,37.26 40.33,37.11 39.62,37.11 IC2.5
  Top 0.406: 39.57,39.08 38.31,39.08 38,39.39 38,40.31 | IC2.5 35.51,37.15 34.84,36.48 34.84,36.46 34.8,36.42 34.8,33.29 C20.2
  Top 1.27: L3.1 40.74,46.66 D4.C 40.58,42.89 38,40.31
N$30
  Top 0.406: C26.1 36.53,34.24 37.32,35.03 37.51,35.03 38.32,35.84 IC2.7
N$32  (via drill 0.6)
  Top 0.406: IC2.11 46.69,36.49 v46.7,36.51 | v56.09,42.73 57.29,42.73 C24.1 C23.1
  Bottom 0.406: v46.7,36.51 46.97,36.51 48.33,37.87 49.5,37.87 52.18,40.55 52.19,40.55 54.37,42.73 v56.09,42.73
N$33
  Top 1.27: C23.2 R9.2
N$35
  Top 1.27: U$7.P$1 18,38.59 17.35,37.94 17.35,34.14 D7.A
PE
  Top 0.406: 16.38,29.3 C16.2 14.97,29.68 | X7.3 13.37,24.96 14.29,25.88 14.29,29 14.97,29.68 | X7.5 14.2,30.45 14.97,29.68
RESET
  Top 0.406: U$1.31 80.72,19.48 82.47,17.73 92.52,17.73 94.95,15.3 97.65,15.3 97.74,15.39 97.79,15.39 97.95,15.55 97.95,16.19 R1.1 98.05,16.45 98.05,26.17 96.52,27.7 CON1.5
SCLK
  Top 0.406: U$1.12 79.12,30.51 76.22,33.41 73.73,33.41 71.43,35.71 71.43,41.82 73.84,44.23 87.13,44.23 89.18,42.18 89.18,40.64 89.92,39.9 89.92,32.78 94.29,28.41 94.27,27.22 CON1.3
V+  (via drill 0.6)
  Top 0.406: L1.2 69.06,34.11 C7.+ | C7.+ 69.2,32.69 69.76,32.13 69.94,31.95 | U$1.19 74.38,26.51 73.63,26.51 73.16,26.98 73.16,30.99 72.2,31.95 69.94,31.95 | C8.1 65.61,31.73 67.75,33.87 69.1,33.87 C7.+ | R4.2 70.15,26.09 70.94,26.88 70.94,28.56 v71.18,28.8 | v70.06,31.05 70.06,31.83 69.94,31.95
  Bottom 0.406: v71.18,28.8 71.18,29.93 v70.06,31.05